# EAGLE design pressure_boardV20 (EAGLE 5.09)
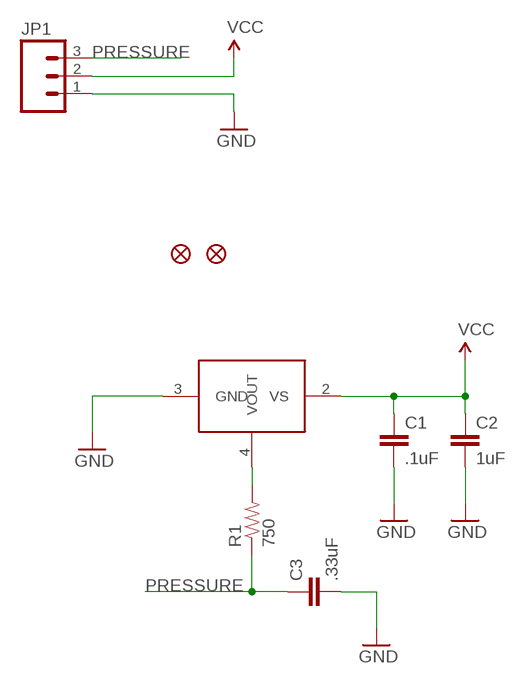
[diagram p0: schematic, sheet 1]

## Parts
C1  .1uF  CAP0402  [C0402]
C2  1uF  CAP0402  [C0402]
C3  .33uF  CAP0402  [C0402]
JP1  M03PTH  [1X03]
JP2  FIDUCIAL1X2  [FIDUCIAL-1X2]
JP3  FIDUCIAL1X2  [FIDUCIAL-1X2]
R1  750  RESISTOR0402  [C0402]
U$1  MPXA6115A6U  [CASE482]

## Nets
GND: C1.2 C2.2 C3.2 JP1.1 U$1.3(GND)
N$1: R1.2 U$1.4(VOUT)
PRESSURE: C3.1 JP1.3 R1.1
VCC: C1.1 C2.1 JP1.2 U$1.2(VS)

## Library data of the parts
C1-C3 = SparkFun:CAP: Capacitor Standard 0603 ceramic capacitor, and 0.1" leaded capacitor.
JP1 = SparkFun:M03: Header 3 Standard 3-pin 0.1" header. Use with straight break away headers (SKU : PRT-00116), right angle break away headers (PRT-00553), swiss pins (PRT-00743), machine pins (PRT-00117), and female headers (PRT-00115). Molex polarized connector foot print use with SKU : PRT-08232 with associated crimp pins and housings.
JP2 JP3 = SparkFun:FIDUCIAL: Fiducial Alignment Points Various fiducial points for machine vision alignment.
R1 = SparkFun:RESISTOR: Resistor Basic schematic elements and footprints for 0603, 1206, and PTH 1/10th watt (small) resistors.
U$1 = paparazzi:MPXA6115A6U: Pressure sensor

## Board
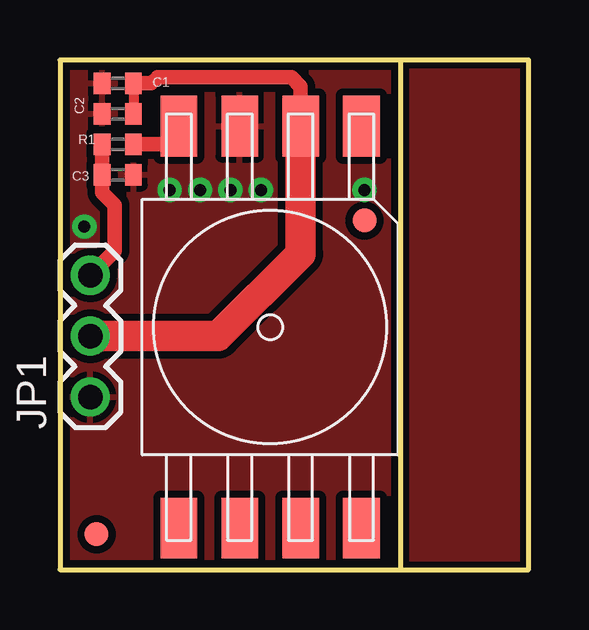
[diagram p1: board, top side]
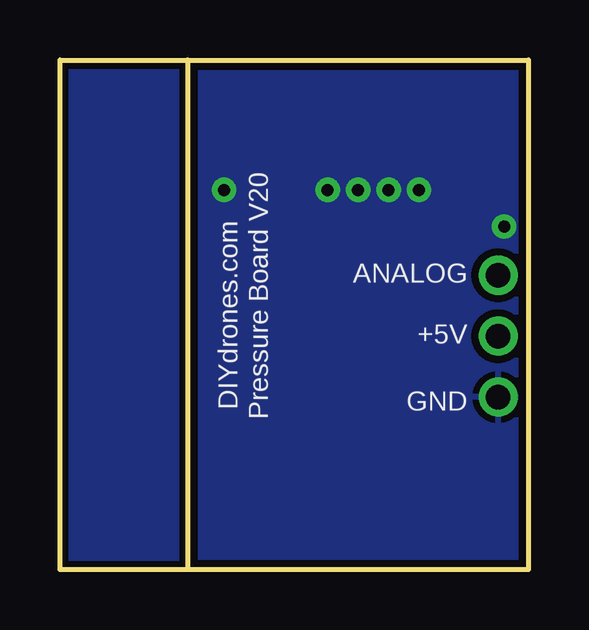
[diagram p2: board, bottom side, seen from below]

Size 19.54 x 21.26 mm. Coordinates in mm from the lower left corner, seen from the top.
Outline: 14.22,21.26 19.54,21.26 19.54,0 14.22,0
Outline: 0,0 14.2,0 14.2,21.26 0,21.26 0,0
Copper layers (1*16): Top 0.035mm / dielectric 1.5mm / Bottom 0.035mm
Design rules "SparkFun": minimum track width 8mil, minimum drill 20mil, track to track 8mil, track to pad 8mil, pad to pad 8mil, via to via 8mil, smd to smd 8mil, copper to edge 10mil, drill to drill 8mil, minimum pad ring 12mil, minimum via ring 10mil, stop-mask expansion 4mil, vias tented up to drill 25mil, thermal gap 10mil

### Footprints (pad centres in the part's own frame; a part is rotated, then mirrored left to right if it is on the bottom)
C0402 = smd 0.7 x 0.9: 1 -0.65,0; 2 0.65,0
1X03 = drill 1.016: 1 0,0; 2 2.54,0; 3 5.08,0
FIDUCIAL-1X2 = smd 1 x 1: 1 0,0
CASE482 = smd 2.54 x 1.524: 1 8.382,0; 2 8.382,2.54; 3 8.382,5.08; 4 8.382,7.62; 5 -8.382,7.62; 6 -8.382,5.08; 7 -8.382,2.54; 8 -8.382,0

### Placement (x,y rotation side)
C1  2.41,20.28 180 top
C2  2.41,19.01 180 top
C3  2.41,16.47 0 top
JP1  1.27,7.2 90 top
JP2  12.7,14.57 0 top
JP3  1.52,1.49 0 top
R1  2.41,17.74 0 top
U$1  12.57,10.12 90 top

### Tracks (layer width: path | path; a pad name or v marks a point on that pad's centre or on a via)
GND  (via drill 0.51)
  other vias: 5.84,15.84 7.11,15.84 8.38,15.84 12.7,15.84 4.57,15.84 1.01,14.31
  pour Top (isolate 0.305): 0.12,21.3 13.96,21.3 13.96,0.09 0.12,0.09
  pour Bottom (isolate 0.305): 0.12,21.3 14.09,21.3 13.96,0.09 -0.01,0.09
N$1
  Top 0.406: 4.95,17.74 U$1.4
  Top 0.61: R1.2 4.95,17.74
N$2
  pour Top: 19.68,21.3 19.68,-0.04 14.35,-0.04 14.35,21.3
N$3
  pour Bottom: 14.35,21.3 19.68,21.3 19.68,-0.04 14.35,-0.04
PRESSURE
  Top 0.61: R1.1 C3.1 1.76,15.72 2.28,15.2 2.28,13.3 JP1.3
VCC
  Top 0.406: C1.1 C2.1
  Top 0.61: U$1.2 10.03,20.16 9.65,20.54 4.06,20.54 3.8,20.28 C1.1
  Top 1.27: JP1.2 6.6,9.74 10.03,13.17 U$1.2 10.03,19.01

### Text on the board
bPlace: Pressure Board V20 | DIYdrones.com | ANALOG | +5V | GND